# EAGLE schematic ethernet_switch_single (EAGLE 6.3)
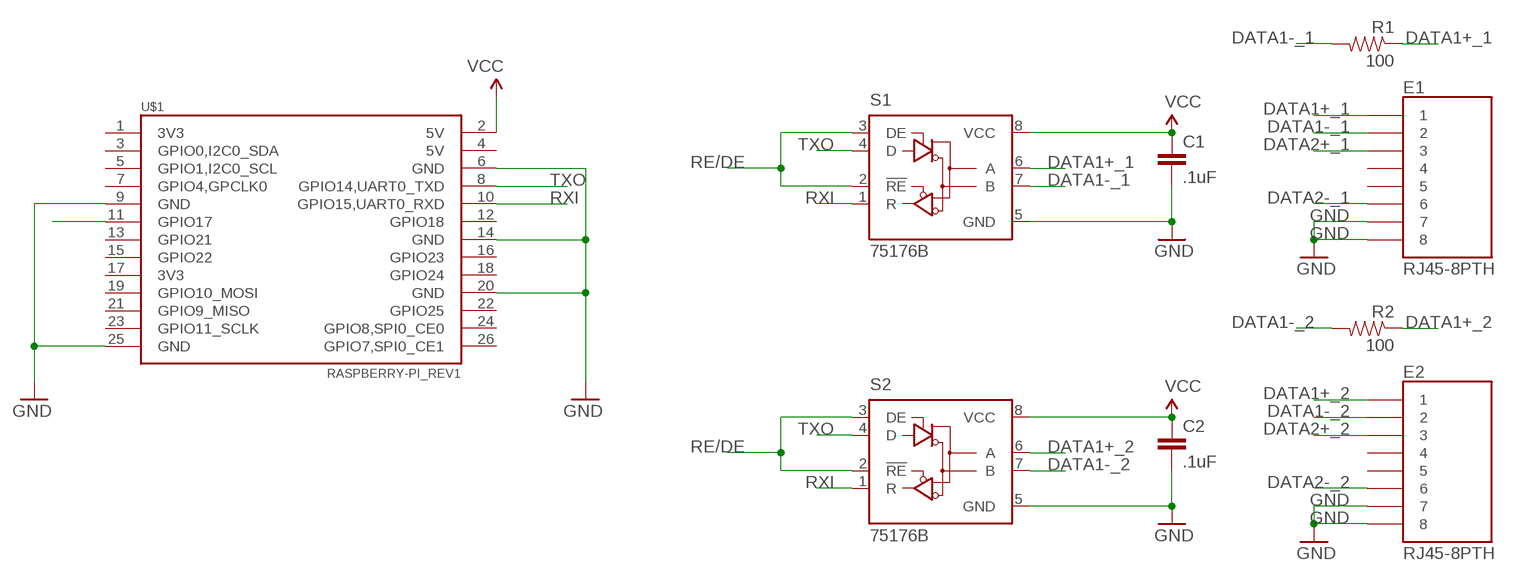
[diagram p0: schematic, sheet 1]

## Parts
C1  .1uF  CAP0402-CAP  [0402-CAP]
C2  .1uF  CAP0402-CAP  [0402-CAP]
E1  RJ45-8PTH  [RJ45-8]
E2  RJ45-8PTH  [RJ45-8]
R1  100  RESISTOR1206  [1206]
R2  100  RESISTOR1206  [1206]
S1  75176B  [D_R-PDSO-G8]
S2  75176B  [D_R-PDSO-G8]
U$1  RASPBERRY-PI_REV1  [RASPBERRY-PI_REV1]

## Nets
DATA1+_1: E1.1 R1.1 S1.6(A)
DATA1+_2: E2.1 R2.1 S2.6(A)
DATA1-_1: E1.2 R1.2 S1.7(B)
DATA1-_2: E2.2 R2.2 S2.7(B)
DATA2+_1: E1.3
DATA2+_2: E2.3
DATA2-_1: E1.6
DATA2-_2: E2.6
GND: C1.2 C2.2 E1.7 E1.8 E2.7 E2.8 S1.5(GND) S2.5(GND) U$1.6(GND) U$1.9(GND) U$1.14(GND) U$1.20(GND) U$1.25(GND)
RE/DE: S1.2(!RE) S1.3(DE) S2.2(!RE) S2.3(DE) U$1.11(GPIO17)
RXI: S1.1(R) S2.1(R) U$1.10(GPIO15,UART0_RXD)
TXO: S1.4(D) S2.4(D) U$1.8(GPIO14,UART0_TXD)
VCC: C1.1 C2.1 S1.8(VCC) S2.8(VCC) U$1.2(5V)
Unconnected: E1.4 E1.5 E2.4 E2.5 U$1.1(3V3) U$1.3(GPIO0,I2C0_SDA) U$1.4(5V) U$1.5(GPIO1,I2C0_SCL) U$1.7(GPIO4,GPCLK0) U$1.12(GPIO18) U$1.13(GPIO21) U$1.15(GPIO22) U$1.16(GPIO23) U$1.17(3V3) U$1.18(GPIO24) U$1.19(GPIO10_MOSI) U$1.21(GPIO9_MISO) U$1.22(GPIO25) U$1.23(GPIO11_SCLK) U$1.24(GPIO8,SPI0_CE0) U$1.26(GPIO7,SPI0_CE1)

## Library data of the parts
C1 C2 = SparkFun-Capacitors:CAP: Capacitor Standard 0603 ceramic capacitor, and 0.1" leaded capacitor.
E1 E2 = SparkFun-Connectors:RJ45-8: RJ45 Jack Simple RJ45, 8-pin connection - connector for common Cat5, Cat5e, and Cat6 Ethernet cables. Footprint not yet proven in production. Connector sku is PRT-00643; Breakout PCB sku is BOB-00716.
R1 R2 = SparkFun-Passives:RESISTOR: Resistor Basic schematic elements and footprints for 0603, 1206, and PTH resistors.
S1 S2 = 751xx:75176B: 75176B
U$1 = RaspberryPi:RASPBERRY-PI_REV1: Raspberry Pi Board <http://www.raspberrypi.org/> Jacques Lagnel V1.0 (beta) 2012 Mateusz Bawaj V1.1 (beta) 2012 Board dimension: Forum 3D model <http://www.raspberrypi.org/forum/general-discussion/mechanical-profile-3d-models?value=3d%20model&type=1&include=1&search=1&ret=all> The GPIO Connector (P1): http://elinux.org/RPi_Low-level_peripherals

## Net classes
1 vcc: width 0.254 mm